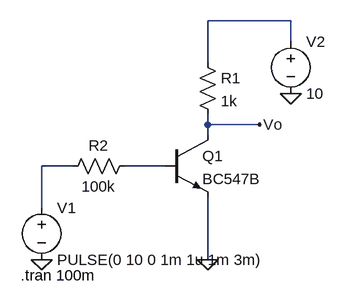
[diagram p0: schematic lab3.3.asc]
lab3.3.asc, the LTspice schematic file:
Version 4
SHEET 1 880 680
WIRE 224 48 96 48
WIRE 224 80 224 48
WIRE 96 112 96 48
WIRE 96 208 96 192
WIRE 176 208 96 208
WIRE 96 224 96 208
WIRE -112 272 -160 272
WIRE 32 272 -32 272
WIRE -160 336 -160 272
WIRE 96 416 96 320
FLAG 224 160 0
FLAG -160 416 0
FLAG 96 416 0
FLAG 176 208 Vo
SYMBOL npn 32 224 R0
SYMATTR InstName Q1
SYMATTR Value BC547B
SYMBOL res 80 96 R0
SYMATTR InstName R1
SYMATTR Value 1k
SYMBOL res -16 256 R90
WINDOW 0 0 56 VBottom 2
WINDOW 3 32 56 VTop 2
SYMATTR InstName R2
SYMATTR Value 100k
SYMBOL voltage -160 320 R0
WINDOW 123 0 0 Left 0
WINDOW 39 0 0 Left 0
SYMATTR InstName V1
SYMATTR Value PULSE(0 10 0 1m 1u 1m 3m)
SYMBOL voltage 224 64 R0
WINDOW 123 0 0 Left 0
WINDOW 39 0 0 Left 0
SYMATTR InstName V2
SYMATTR Value 10
TEXT -192 440 Left 2 !.tran 100m

The netlist it stands for:
* lab3.3.asc
Q1 Vo N003 0 0 BC547B
R1 N001 Vo 1k
R2 N003 N002 100k
V1 N002 0 PULSE(0 10 0 1m 1u 1m 3m)
V2 N001 0 10
.model NPN NPN
.model PNP PNP
.lib standard.bjt
.tran 100m
.backanno
.end